# EAGLE design triac (EAGLE 4.13)
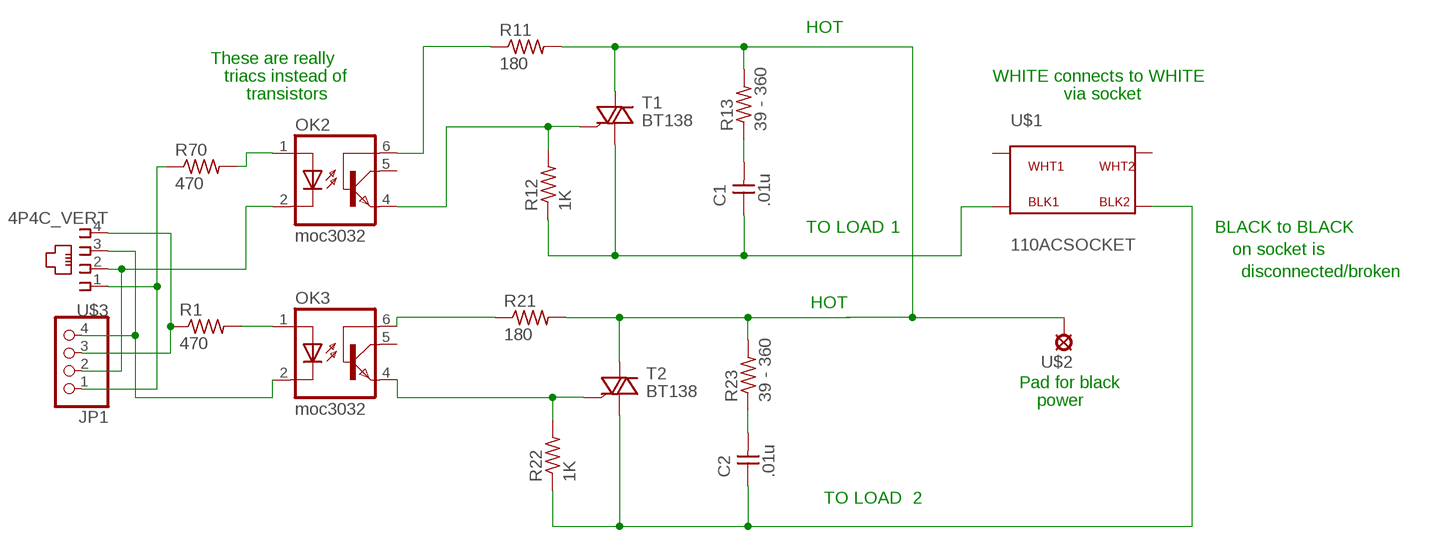
[diagram p0: schematic, sheet 1]

## Parts
C1  .01u  C-0P1  [C-0P1]
C2  .01u  C-0P1  [C-0P1]
JP1  PINHD-1X4  [1X04]
OK2  moc3032  4N35  [DIL06]
OK3  moc3032  4N35  [DIL06]
R1  470  R-US_R0603  [R0603]
R11  180  R-US_R0603  [R0603]
R12  1K  R-US_R0603  [R0603]
R13  39 - 360  R-US_R0603  [R0603]
R21  180  R-US_R0603  [R0603]
R22  1K  R-US_R0603  [R0603]
R23  39 - 360  R-US_R0603  [R0603]
R70  470  R-US_R0603  [R0603]
T1  BT138  TIC225S  [TO220DS]
T2  BT138  TIC225S  [TO220DS]
U$1  110ACSOCKET  [110ACSOCKET]
U$2  9MMSQ  [SOLPAD9MMSQ]
U$3  4P4C_VERT  [MOD4P4C_VERT]

## Nets
G1: OK2.4(EMI) R12.2 T1.G
G2: OK3.4(EMI) R22.2 T2.G
HOT: R11.2 R13.2 R21.2 R23.2 T1.A2 T2.A2 U$2.MP
O1_NEG: JP1.2 OK2.2(C) U$3.2
O1_PLUS: OK2.1(A) R70.2
O1_R: JP1.1 R70.1 U$3.1
O2_PLUS: OK3.1(A) R1.2
O2_R: JP1.3 R1.1 U$3.4
OC2_NEG: JP1.4 OK3.2(C) U$3.3
RC1: C1.P$2 R13.1
RC2: C2.P$2 R23.1
T1: OK2.6(BAS) R11.1
T2: OK3.6(BAS) R21.1
TO_LOAD_1: C1.P$1 R12.1 T1.A1 U$1.B1
TO_LOAD_2: C2.P$1 R22.1 T2.A1 U$1.B2
Unconnected: OK2.5(COL) OK3.5(COL) U$1.W1 U$1.W2

## Notes on the sheet
- HOT
- These are really
- triacs instead of | WHITE connects to WHITE
- transistors | via socket
- TO LOAD | 1 | BLACK to BLACK
- on socket is
- disconnected/broken
- HOT
- Pad for black
- power
- TO LOAD | 2

## Library data of the parts
C1 C2 = DEH:C-0P1
JP1 = pinhead:PINHD-1X4: PIN HEADER
OK2 OK3 = optocoupler-2:4N35: MOTOROLA OPTO COUPLER
R1 R11-R13 R21-R23 R70 = rcl:R-US_: RESISTOR, American symbol
T1 T2 = triac:TIC225S: TRIAC
U$1 = DEH:110ACSOCKET
U$2 = solpad:9MMSQ
U$3 = DEH:4P4C_VERT

## Board
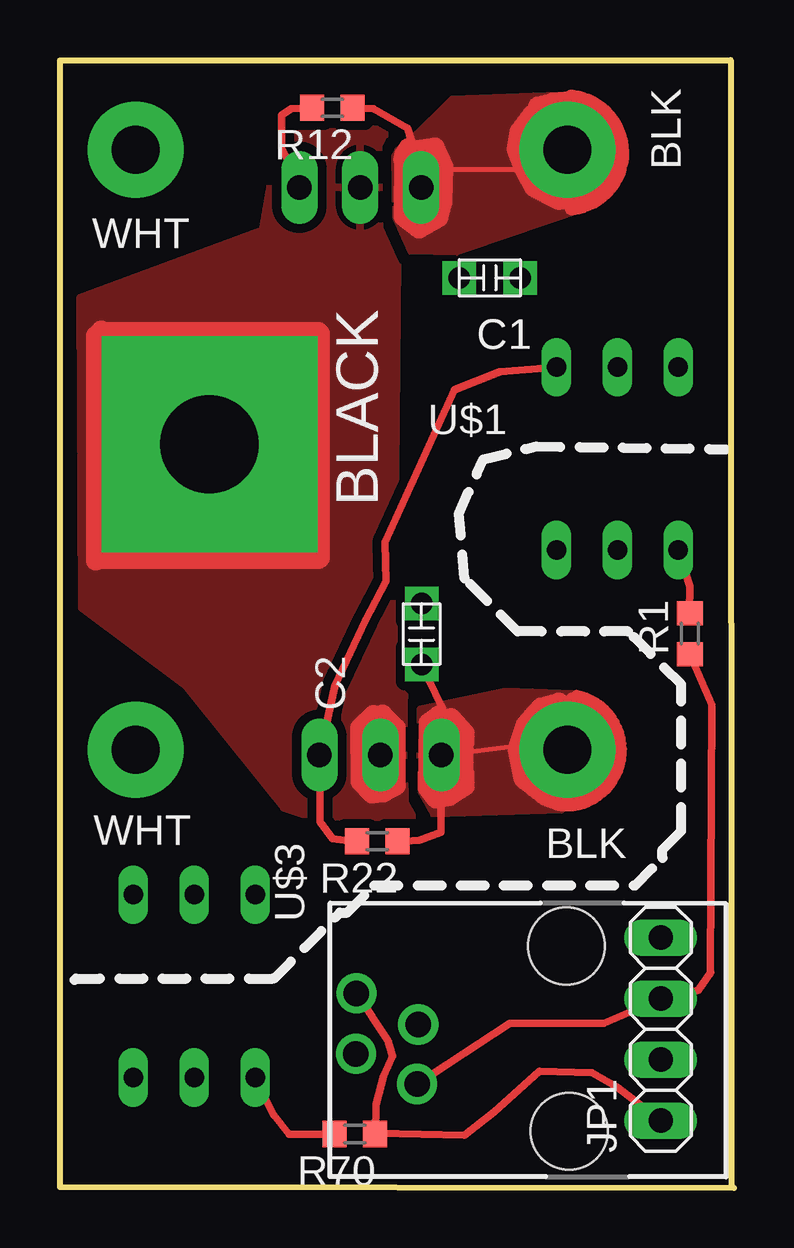
[diagram p1: board, top side]
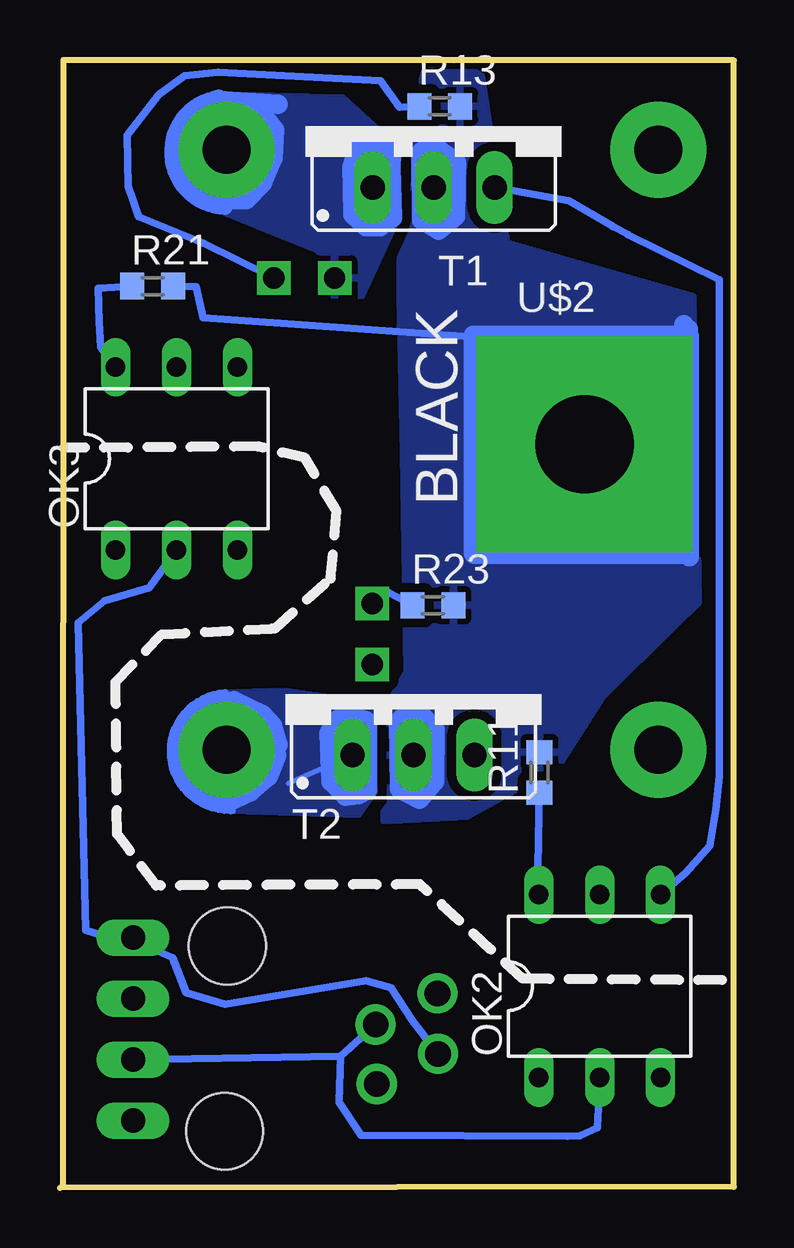
[diagram p2: board, bottom side, seen from below]

Size 28.1 x 46.99 mm. Coordinates in mm from the lower left corner, seen from the top.
Outline: 0,0.05 0,46.97 27.96,46.99 27.99,0.09
Outline: 0.01,0.04 28.1,0
Copper layers (1*16): Top 0.035mm / dielectric 1.5mm / Bottom 0.035mm
Design rules "default": minimum track width 8mil, minimum drill 0.6mm, track to track 15mil, track to pad 15mil, pad to pad 10mil, via to via 10mil, smd to smd 0mil, copper to edge 8mil, drill to drill 8mil, minimum pad ring 8mil, minimum via ring 8mil, stop-mask expansion 4mil, vias tented up to drill 0mil, thermal gap 10mil

### Footprints (pad centres in the part's own frame; a part is rotated, then mirrored left to right if it is on the bottom)
C-0P1 = drill 0.889 pad 1.397 square: P$1 -1.27,0; P$2 1.27,0
1X04 = drill 1.016 long: 1 -3.81,0; 2 -1.27,0; 3 1.27,0; 4 3.81,0
DIL06 = drill 0.813 long: 1 -2.54,-3.81; 2 0,-3.81; 3 2.54,-3.81; 4 2.54,3.81; 5 0,3.81; 6 -2.54,3.81
R0603 = smd 1 x 1.1: 1 -0.85,0; 2 0.85,0
TO220DS = drill 1.016 long: A1 -2.54,-2.54; A2 0,-2.54; G 2.54,-2.54
110ACSOCKET = drill 2 pad 4 round: B1 9,12.5; B2 9,-12.5; W1 -9,12.5; W2 -9,-12.5
SOLPAD9MMSQ = drill 4.1 pad 9 square: MP 0,0
MOD4P4C_VERT = drill 1.067 pad 1.676 round: 1 1.89,8.86; 2 0.59,6.28; 3 -0.63,8.88; 4 -1.89,6.33 | hole 3.2: -3.85,-0.01; 3.86,0.1

### Placement (x,y rotation side)
C1  17.92,37.91 0 top
C2  15.08,23.07 90 top
JP1  25.05,6.61 90 top
OK2  5.6,8.4 0 bottom
OK3  23.24,30.38 0 bottom
R1  26.26,23.09 90 top
R11  8.11,17.3 90 bottom
R12  11.35,45 180 top
R13  12.27,45.06 0 bottom
R21  24.24,37.57 0 bottom
R22  13.23,14.44 180 top
R23  12.55,24.27 0 bottom
R70  12.29,2.24 180 top
T1  12.52,44.22 0 bottom
T2  13.36,20.57 0 bottom
U$1  12.15,30.75 0 top
U$2  6.23,30.98 0 bottom
U$3  21.22,6.21 90 top

### Tracks (layer width: path | path; a pad name or v marks a point on that pad's centre or on a via)
G1
  Top 0.305: R12.2 9.63,44.95 9.23,44.69 9.23,43.34 10.07,41.6 T1.G
  Bottom 0.305: T1.G 6.89,41.12 5.04,40.07 | OK2.4 2.01,13.13 1.01,14.25 0.75,15.76 0.61,17.14 0.61,37.84 4.43,39.71 4.41,39.71 5.04,40.07 | 5.04,40.07 5.05,40.05
G2
  Top 0.305: OK3.4 18.35,34 16.45,33.25 13.56,26.9 13.6,25.28 12.73,23.64 11.46,20.93 T2.G 10.85,15.26 11.37,14.54 12.34,14.42 R22.2
HOT
  Top 0.813: 13.07,19.71 12.52,19.16 12.54,16.92 13.02,16.41 13.47,16.46 14.02,16.75 14.02,19.17 13.44,19.73 | 1.71,35.72 1.49,35.5 1.49,26.12 1.55,26.18 10.79,26.18 10.84,26.23 10.84,35.61 10.79,35.66 1.8,35.66
  Bottom 0.203: U$2.MP 10.71,35.44 | 12.72,16.64 12.61,16.54 12.52,16.45
  Bottom 0.305: 10.71,35.44 22.14,36.25 22.42,37.54 R21.2
  Bottom 0.813: 12.44,43.34 11.57,42.74 11.62,40.47 12.31,39.89 13.02,40.34 13.04,43.14 12.44,43.56 | 13.16,19.81 12.46,19.11 12.49,16.91 12.72,16.64 13.12,16.19 13.94,16.63 13.99,19.41 13.62,19.78 | 2.1,35.96 1.91,35.77 1.91,35.52 1.86,35.47 1.86,26.3 1.96,26.4 10.84,26.4 10.87,26.43 10.87,35.52 2.1,35.52
  pour Bottom (rank 2): 10.79,46.49 12.9,46.45 13.89,43.1 13.93,37.24 13.77,30.61 13.63,21.51 14.81,19.43 14.59,15.29 11.92,15.44 11.14,15.49 7.37,17.55 5.47,20.51 1.49,24.39 1.71,37.13 9.48,39.35 10.52,46.3
  pour Top (rank 2): 9.69,46.26 13.51,46.26 14.08,38.69 13.91,20.94 14.95,20 15.08,14.91 11.57,15.08 9.33,15.83 5.19,20.96 0.91,24.16 0.85,37.08 8.45,39.9 9.46,45.79
O1_NEG
  Bottom 0.305: 16.4,5.47 U$3.2 | 16.4,5.47 16.47,3.57 15.54,2.18 6.95,2.14 6.42,2.16 5.69,2.5 OK2.2 | JP1.2 25.08,5.34 16.4,5.47
O1_PLUS
  Top 0.305: R70.2 9.55,2.23 8.91,3.04 8.21,4.37 OK2.1
O1_R
  Top 0.305: U$3.1 13.67,6.13 13.86,5.49 13.49,4.65 13.18,3.46 13.15,2.27 R70.1 13.24,2.28 16.87,2.19 18.11,3.16 19.99,4.86 22.17,4.8 23.23,4.19 JP1.1
O2_PLUS
  Top 0.305: OK3.1 26.26,25.06 26.23,24 R1.2
O2_R
  Top 0.305: R1.1 27.17,20.12 27.11,8.94 27.14,8.97 26.62,8.22 JP1.3 22.68,6.85 18.75,6.86 U$3.4
OC2_NEG
  Bottom 0.305: U$3.3 13.4,6.95 14.3,8.34 15.33,8.62 21.22,7.65 22.84,8.13 23.41,9.59 25.11,10.36 JP1.4 25.07,10.39 26.37,10.52 27.02,10.73 27.33,23.55 26.23,24.46 24.38,25.01 OK3.2
RC1
  Bottom 0.305: C1.P$2 22.11,39.35 24.82,40.45 25.26,41.74 25.29,43.86 23.99,45.55 22.91,46.33 21.5,46.47 14.74,46.12 13.95,45.02 13.07,45.06 R13.1
RC2
  Bottom 0.305: R23.1 14.39,24.79 14.98,24.76 C2.P$2
T1
  Bottom 0.305: R11.1 8.16,14.53 8.2,12.12 OK2.6
T2
  Bottom 0.305: R21.1 26.51,37.48 26.47,36.09 26.41,35.02 OK3.6
TO_LOAD_1
  Top 0.203: T1.A1 15.81,42.44 19.21,42.44 U$1.B1
  Top 0.305: R12.1 13.07,44.96 14.49,44.14 14.98,42.59 15.07,41.57 T1.A1
  Top 0.61: 21.35,40.82 arc168 21.33,45.45
  Top 0.813: 19.93,45.06 20.55,45.24 21.31,45.29 22.3,44.76 23,43.31 22.82,42.34 21.75,41.34 20.81,41.14 19.78,41.66 19.36,42.42 19.03,43.28 19.15,44.03 19.68,44.71 | 14.54,43.33 14.35,43.05 14.32,40.46 14.96,39.95 15.78,40.42 15.94,41.04 15.99,42.56 15.63,43.36 14.77,43.24 14.31,42.86
  Bottom 0.61: 21.21,40.83 arc170 21.46,45.45
  Bottom 0.813: 19.01,45.14 21.23,45.29 22.53,44.53 22.75,42.93 22.72,41.94 21.03,41.16 20.33,41.16 19.66,41.87 19.21,42.89 19.16,44.08 19.66,44.76 20.2,45.16 | 14.27,42.87 14.89,43.68 15.69,43.36 15.93,42.54 15.89,40.54 15.34,40.04 14.76,40.04 14.24,40.41 14.31,43.19
  pour Top: 14.6,43.65 16.36,45.39 21.41,45.58 22.53,43.53 21.5,40.66 16.52,38.95 14.62,39 13.99,40.4 13.94,42.99 14.07,43.25
  pour Bottom: 14.42,43.69 16.31,45.4 21.39,45.54 23.09,44.1 23.06,42.3 21.16,40.61 17.28,39.05 17.1,37.21 15.53,37.16 14.08,40.28 14.08,43.38
TO_LOAD_2
  Top 0.203: T2.A1 19.21,18.44 U$1.B2
  Top 0.254: 20.9,15.81 arc174 21.51,20.62
  Top 0.305: R22.1 14.04,14.42 14.98,14.48 15.88,14.82 T2.A1 15.91,17.96 15.94,19.98 C2.P$1
  Top 0.813: 15.78,19.69 15.36,19.38 15.33,16.67 15.68,16.21 16.23,16.31 16.89,16.74 16.83,17.96 16.89,18.93 16.31,19.59 | 20.83,20.11 20.81,20.23 20.06,20.03 19.4,19.29 19.08,18.29 19.33,17.04 20.26,16.31 20.83,16.11 21.88,16.31 22.75,16.96 23.13,17.86 23.13,18.77 22.75,19.54 22.28,19.96 21.43,20.26
  Bottom 0.203: T2.A1 18.58,16.84 | 21.01,15.7 21.01,15.74 20.99,15.71 | 19.22,17.64 19.21,17.64 U$1.B2
  Bottom 0.254: 20.9,15.7 arc3 21.01,15.7 arc177 21.2,20.66
  Bottom 0.813: 15.34,19.45 15.79,19.63 16.46,19.55 16.88,18.93 16.79,16.91 16.19,16.31 15.68,16.38 15.28,16.59 15.28,19.33 | 19.01,18.46 19.23,19.25 19.68,19.73 20.83,20.3 21.91,20.15 22.73,19.31 23.2,18.33 22.98,17.33 22.27,16.51 21.18,16.03 20.15,16.51 19.43,17.13 19.22,17.64 19.06,18.03
  pour Top: 20.92,15.71 15.57,15.54 14.99,16.58 15.02,19.97 18.59,20.72 21.44,20.63 21.45,20.63 21.46,20.64
  pour Bottom: 18.78,20.71 21.41,20.62 20.99,15.71 15.64,15.54 14.96,16.48 15.04,20.17

### Text on the board
tNames: BLK | WHT | BLACK | BLK | WHT
bNames: BLACK